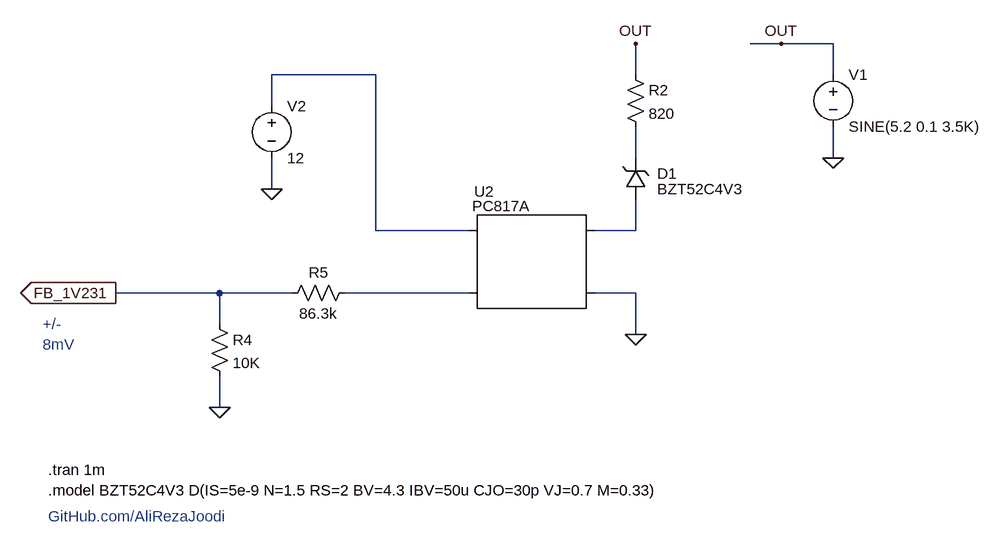
[diagram p0: schematic v1.0.asc]
v1.0.asc, the LTspice schematic file:
Version 4.1
SHEET 1 1116 1460
WIRE -80 224 -128 224
WIRE 0 224 -80 224
WIRE -704 272 -864 272
WIRE -304 272 -304 224
WIRE 0 272 0 224
WIRE -864 320 -864 272
WIRE -304 400 -304 352
WIRE 0 400 0 352
WIRE -864 448 -864 400
WIRE -704 512 -704 272
WIRE -560 512 -704 512
WIRE -304 512 -304 464
WIRE -304 512 -368 512
WIRE -944 608 -1104 608
WIRE -832 608 -944 608
WIRE -560 608 -752 608
WIRE -304 608 -368 608
WIRE -944 656 -944 608
WIRE -304 672 -304 608
WIRE -944 784 -944 736
FLAG -944 784 0
FLAG -80 224 OUT
FLAG -1104 608 FB_1V231
IOPIN -1104 608 Out
FLAG 0 400 0
FLAG -864 448 0
FLAG -304 672 0
FLAG -304 224 OUT
SYMBOL res -960 640 R0
SYMATTR InstName R4
SYMATTR Value 10K
SYMBOL res -736 592 R90
WINDOW 0 0 56 VBottom 2
WINDOW 3 32 56 VTop 2
SYMATTR InstName R5
SYMATTR Value 86.3k
SYMBOL Optos\\PC817A -464 560 M0
WINDOW 0 73 -108 Center 2
WINDOW 3 47 -86 Center 2
SYMATTR InstName U2
SYMBOL voltage 0 256 R0
WINDOW 123 0 0 Left 0
WINDOW 39 0 0 Left 0
SYMATTR InstName V1
SYMATTR Value SINE(5.2 0.1 3.5K)
SYMBOL voltage -864 304 R0
WINDOW 123 0 0 Left 0
WINDOW 39 0 0 Left 0
SYMATTR InstName V2
SYMATTR Value 12
SYMBOL res -320 256 R0
SYMATTR InstName R2
SYMATTR Value 820
SYMBOL zener -320 464 M180
WINDOW 0 49 40 Left 2
WINDOW 3 49 16 Left 2
SYMATTR InstName D1
SYMATTR Value BZT52C4V3
TEXT -1208 880 Left 2 !.tran 1m
TEXT -1208 952 Left 2 ;GitHub.com/AliRezaJoodi
TEXT -1216 656 Left 2 ;+/-\n8mV
TEXT -1208 912 Left 2 !.model BZT52C4V3 D(IS=5e-9 N=1.5 RS=2 BV=4.3 IBV=50u CJO=30p VJ=0.7 M=0.33)

The netlist it stands for:
* v1.0.asc
R4 FB_1V231 0 10K
R5 N004 FB_1V231 86.3k
X§U2 N003 0 N001 N004 PC817 Igain=1m
V1 OUT 0 SINE(5.2 0.1 3.5K)
V2 N001 0 12
R2 OUT N002 820
D1 N003 N002 BZT52C4V3
.model D D
.lib standard.dio
.tran 1m
* GitHub.com/AliRezaJoodi
* +/-
* 8mV
.model BZT52C4V3 D(IS=5e-9 N=1.5 RS=2 BV=4.3 IBV=50u CJO=30p VJ=0.7 M=0.33)
.lib PC817.sub
.backanno
.end